# Altium project 探测器.PrjPcb
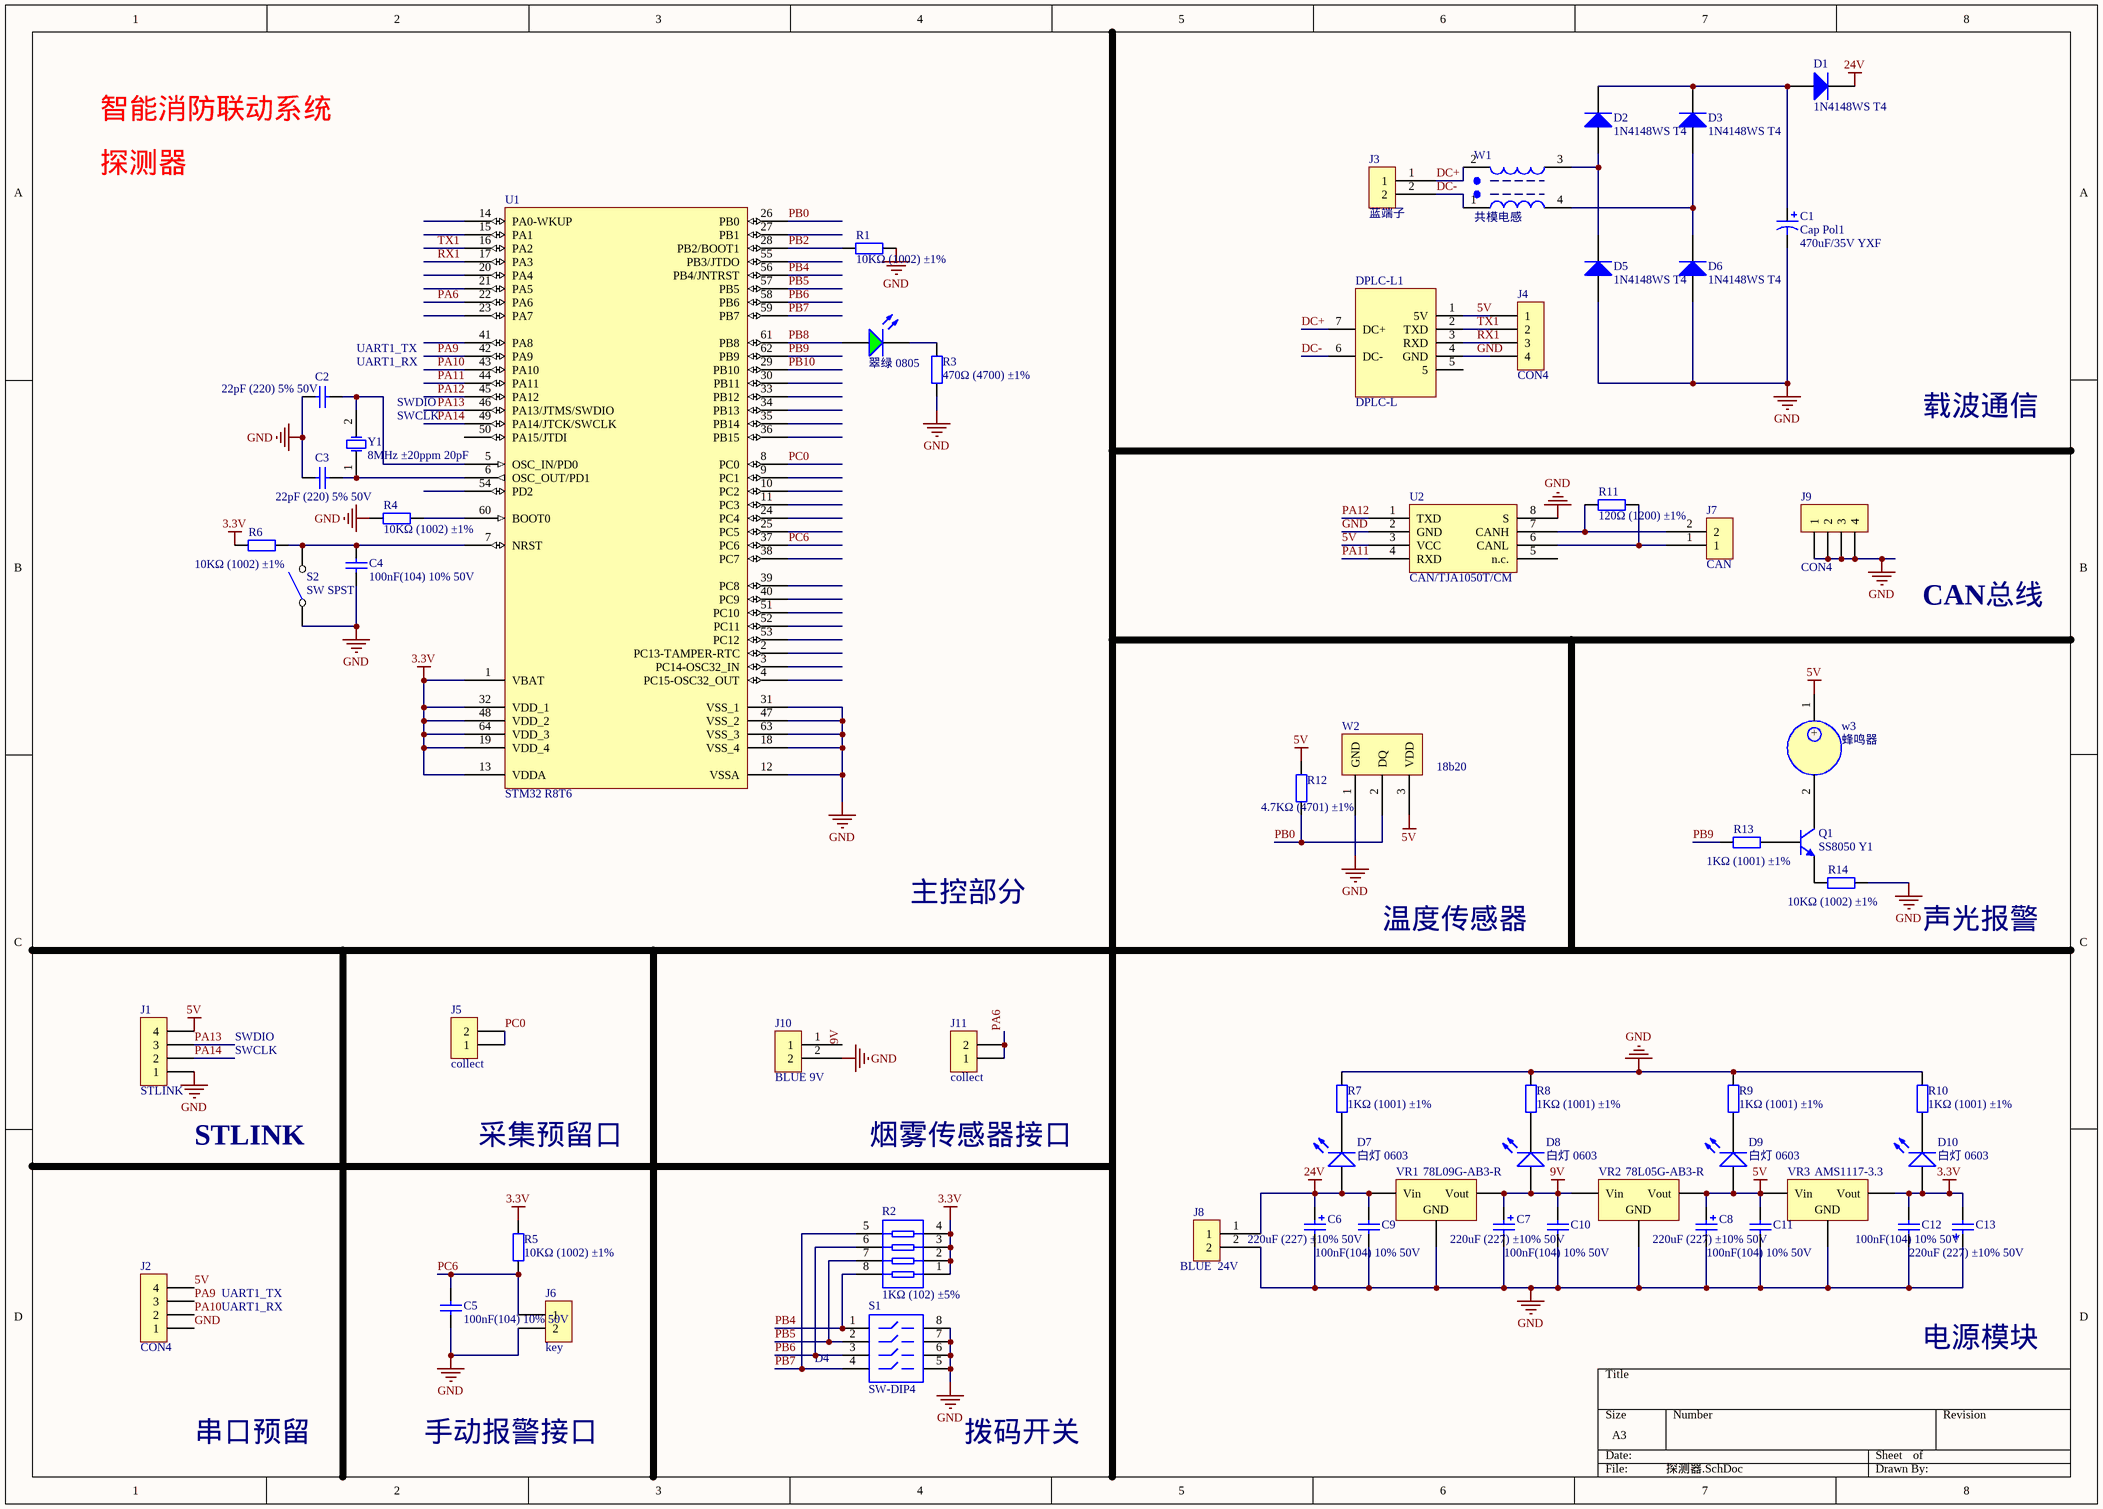
[diagram p0: 探测器.SchDoc]
1 sheet, 61 parts. Net scope: global (net labels, ports and power ports of the same name join across sheets).
Board file: 探测器终.PcbDoc

## Sheet 探测器.SchDoc: 智能消防联动系统
size A3; Time: 2017.05.04; ProjectName: 探测器

### Parts
C1  Cap Pol1  value 470uF/35V YXF  [RB.2/.4]
C2  22pF (220) 5% 50V  [LC-0805_C]
C3  22pF (220) 5% 50V  [LC-0805_C]
C4  100nF(104) 10% 50V  [LC-0805_C]
C5  100nF(104) 10% 50V  [LC-0805_C]
C6  220uF (227) ±10% 50V  [LC-CASE-B_3528]
C7  220uF (227) ±10% 50V  [LC-CASE-B_3528]
C8  220uF (227) ±10% 50V  [LC-CASE-B_3528]
C9  100nF(104) 10% 50V  [LC-0805_C]
C10  100nF(104) 10% 50V  [LC-0805_C]
C11  100nF(104) 10% 50V  [LC-0805_C]
C12  100nF(104) 10% 50V  [LC-0805_C]
C13  220uF (227) ±10% 50V  [LC-CASE-B_3528]
D1  1N4148WS T4  [LC-SOD-323]
D2  1N4148WS T4  [LC-SOD-323]
D3  1N4148WS T4  [LC-SOD-323]
D4  翠绿 0805  [LC-0805_LED_S1]
D5  1N4148WS T4  [LC-SOD-323]
D6  1N4148WS T4  [LC-SOD-323]
D7  白灯 0603  [LC-0603_LED_S1]
D8  白灯 0603  [LC-0603_LED_S1]
D9  白灯 0603  [LC-0603_LED_S1]
D10  白灯 0603  [LC-0603_LED_S1]
DPLC-L1  DPLC-L  [DPLC-L]
J1  STLINK  [SIP4]
J2  CON4  [SIP4]
J3  蓝端子  [蓝端子]
J4  CON4  [SIP4]
J5  collect  [SIP2]
J6  key  [SIP2]
J7  CAN  [蓝端子]
J8  BLUE  24V  [蓝端子]
J9  CON4  [SIP4]
J10  BLUE 9V  [蓝端子]
J11  collect  [SIP2]
Q1  SS8050 Y1  [LC-SOT-23(SOT-23-3)]
R1  10KΩ (1002) ±1%  [LC-0805_R]
R2  1KΩ (102) ±5%  [LC-0603_Rx4]
R3  470Ω (4700) ±1%  [LC-0805_R]
R4  10KΩ (1002) ±1%  [LC-0805_R]
R5  10KΩ (1002) ±1%  [LC-0805_R]
R6  10KΩ (1002) ±1%  [LC-0805_R]
R7  1KΩ (1001) ±1%  [LC-0603_R]
R8  1KΩ (1001) ±1%  [LC-0603_R]
R9  1KΩ (1001) ±1%  [LC-0603_R]
R10  1KΩ (1001) ±1%  [LC-0603_R]
R11  120Ω (1200) ±1%  [LC-0805_R]
R12  4.7KΩ (4701) ±1%  [LC-0805_R]
R13  1KΩ (1001) ±1%  [LC-0805_R]
R14  10KΩ (1002) ±1%  [LC-0805_R]
S1  SW-DIP4  [4位拨码开关]
S2  SW SPST  [单片机小按键]
U1  STM32 R8T6  [LC-LQFP-64_10x10x05P]
U2  CAN/TJA1050T/CM  [LC-SOIC-8_150mil]
VR1  78L09G-AB3-R  [LC-SOT-89(SOT-89-3)]
VR2  78L05G-AB3-R  [LC-SOT-89(SOT-89-3)]
VR3  AMS1117-3.3  [LC-SOT-223]
W1  共模电感  [共模电感]
W2  18b20  [DS18B20]
w3  蜂鸣器  [蜂鸣器]
Y1  8MHz ±20ppm 20pF  [LC-SMD-5032_2P]

### Nets
3.3V: C12.1 C13.2 D10.A R2.1 R2.2 R2.3 R2.4 R5.2 R6.1 U1.1(VBAT) U1.13(VDDA) U1.19(VDD_4) U1.32(VDD_1) U1.48(VDD_2) U1.64(VDD_3) VR3.2(Vout)
5V: C8.1 C11.2 D9.A DPLC-L1.1(5V) J1.4 J2.4 J4.1 R12.2 U2.3(VCC) VR2.3(Vout) VR3.3(Vin) W2.3(VDD) w3.1(+)
9V: C7.1 C10.2 D8.A J10.1 VR1.3(Vout) VR2.1(Vin)
24V: C6.1 C9.2 D1.2(K) D7.A J8.1 VR1.1(Vin)
GND: C1.2 C2.1 C3.1 C4.1 C5.1 C6.2 C7.2 C8.2 C9.1 C10.1 C11.1 C12.2 C13.1 D5.1(A) D6.1(A) DPLC-L1.4(GND) J1.1 J2.1 J4.4 J6.2 J8.2 J9.1 J9.2 J9.3 J9.4 J10.2 R1.1 R3.1 R4.1 R7.1 R8.1 R9.1 R10.1 R14.2 S1.5 S1.6 S1.7 S1.8 S2.1(COMMON) U1.12(VSSA) U1.18(VSS_4) U1.31(VSS_1) U1.47(VSS_2) U1.63(VSS_3) U2.2(GND) U2.8(S) VR1.2(GND) VR2.2(GND) VR3.1(GND) W2.1(GND)
DC+: DPLC-L1.7(DC+) J3.1 W1.2
DC-: DPLC-L1.6(DC-) J3.2 W1.1
PA6: J11.1 J11.2 U1.22(PA6)
PA9: J2.3 U1.42(PA9)
PA10: J2.2 U1.43(PA10)
PA11: U1.44(PA11) U2.4(RXD)
PA12: U1.45(PA12) U2.1(TXD)
PA13: J1.3 U1.46(PA13/JTMS/SWDIO)
PA14: J1.2 U1.49(PA14/JTCK/SWCLK)
PB0: R12.1 U1.26(PB0) W2.2(DQ)
PB2: R1.2 U1.28(PB2/BOOT1)
PB4: R2.8 S1.1 U1.56(PB4/JNTRST)
PB5: R2.7 S1.2 U1.57(PB5)
PB6: R2.6 S1.3 U1.58(PB6)
PB7: R2.5 S1.4 U1.59(PB7)
PB8: D4.A U1.61(PB8)
PB9: R13.1 U1.62(PB9)
PB10: U1.29(PB10)
PC0: J5.1 J5.2 U1.8(PC0)
PC6: C5.2 J6.1 R5.1 U1.37(PC6)
RX1: DPLC-L1.3(RXD) J4.3 U1.17(PA3)
TX1: DPLC-L1.2(TXD) J4.2 U1.16(PA2)
NetC1_1: C1.1 D1.1(A) D2.2(K) D3.2(K)
NetC2_2: C2.2 U1.5(OSC_IN/PD0) Y1.2(OSC2)
NetC3_2: C3.2 U1.6(OSC_OUT/PD1) Y1.1(OSC1)
NetC4_2: C4.2 R6.2 S2.2(NO) U1.7(NRST)
NetD2_1: D2.1(A) D5.2(K) W1.3
NetD3_1: D3.1(A) D6.2(K) W1.4
NetD4_K: D4.K R3.2
NetD7_K: D7.K R7.2
NetD8_K: D8.K R8.2
NetD9_K: D9.K R9.2
NetD10_K: D10.K R10.2
NetJ7_1: J7.1 R11.2 U2.6(CANL)
NetJ7_2: J7.2 R11.1 U2.7(CANH)
NetQ1_1: Q1.1(B) R13.2
NetQ1_2: Q1.2(E) R14.1
NetQ1_3: Q1.3(C) w3.2
NetR4_2: R4.2 U1.60(BOOT0)

Not connected (* = marked no-connect by the designer): DPLC-L1 5; U1 2(PC13-TAMPER-RTC) 3(PC14-OSC32_IN) 4(PC15-OSC32_OUT) 9(PC1) 10(PC2) 11(PC3) 14(PA0-WKUP) 15(PA1) 20(PA4) 21(PA5) 23(PA7) 24(PC4) 25(PC5) 27(PB1) 30(PB11) 33(PB12) 34(PB13) 35(PB14) 36(PB15) 38(PC7) 39(PC8) 40(PC9) 41(PA8) 50(PA15/JTDI) 51(PC10) 52(PC11) 53(PC12) 54(PD2) 55(PB3/JTDO); U2 5(n.c.)

### Notes on the sheet
- 智能消防联动系统
- 探测器
- (near C2) UART1_TX
- (near C2) UART1_RX
- SWDIO
- (near Y1) SWCLK
- 载波通信
- CAN总线
- 主控部分
- 温度传感器
- 声光报警
- SWCLK
- STLINK
- 采集预留口
- 烟雾传感器接口
- UART1_TX
- UART1_RX
- 电源模块
- 串口预留
- 手动报警接口
- 拨码开关

### Library data of the parts
C1 = Cap Pol1: Polarized Capacitor (Radial); Published: 8-Jun-2000; LatestRevisionDate: 17-Jul-2002; LatestRevisionNote: Re-released for DXP Platform.; PackageReference: RB7.6-15; Publisher: Altium Limited; PackageDescription: Polarized Capacitor (Radial); 2 Leads
C2 C3 = 0805 22pF (220) 5% 50V: 贴片电容; ComponentLink1Description: 供应商链接; ComponentLink1URL: http://www.szlcsc.com/product/details_2156.html; Package: 0805; Supplier: LC; SuppliersPartNumber: C1804
C4 C5 C9-C12 = 0805 100nF(104) 10% 50V: 贴片电容; ComponentLink1Description: 供应商链接; ComponentLink1URL: http://www.szlcsc.com/product/details_50686.html; Package: 0805; Supplier: LC; SuppliersPartNumber: C49678
C6-C8 C13 = 3528 100uF (107) 10% 6.3V: 钽电容; ComponentLink1Description: 供应商链接; ComponentLink1URL: http://www.szlcsc.com/product/details_16815.html; Package: 3528; Supplier: LC; SuppliersPartNumber: C16133
D1-D3 D5 D6 = SOD-323 1N4148WS T4: 二极管; ComponentLink1Description: 供应商链接; ComponentLink1URL: http://www.szlcsc.com/product/details_2485.html; Package: SOD-323; Supplier: LC; SuppliersPartNumber: C2128
D4 = 0805 翠绿: 发光二极管; ComponentLink1Description: 供应商链接; ComponentLink1URL: http://www.szlcsc.com/product/details_2670.html; Package: 0805; Supplier: LC; SuppliersPartNumber: C2297
D7-D10 = 0603 白灯: 发光二极管; ComponentLink1Description: 供应商链接; ComponentLink1URL: http://www.szlcsc.com/product/details_2663.html; Package: 0603; Supplier: LC; SuppliersPartNumber: C2290
J1 = CON4
J5 J6 J11 = CON2
J7 J8 J10 = 蓝端子
Q1 = SOT-23 SS8050 Y1: 三极管; ComponentLink1Description: 供应商链接; ComponentLink1URL: http://www.szlcsc.com/product/details_2507.html; Package: SOT-23; Supplier: LC; SuppliersPartNumber: C2150
R1 R4-R6 R14 = 0805 10KΩ (1002) 1%: 贴片电阻; ComponentLink1Description: 供应商链接; ComponentLink1URL: http://www.szlcsc.com/product/details_18102.html; Package: 0805; Supplier: LC; SuppliersPartNumber: C17414
R2 = 0603*4  1KΩ (102) 5%: 贴片排阻; ComponentLink1Description: 供应商链接; ComponentLink1URL: http://www.szlcsc.com/product/details_20907.html; Package: 0603*4; Supplier: LC; SuppliersPartNumber: C20197
R3 = 0805 470Ω (4700) 1%: 贴片电阻; ComponentLink1Description: 供应商链接; ComponentLink1URL: http://www.szlcsc.com/product/details_18398.html; Package: 0805; Supplier: LC; SuppliersPartNumber: C17710
R7-R10 = 0603 1KΩ (1001) 1%: 贴片电阻; ComponentLink1Description: 供应商链接; ComponentLink1URL: http://www.szlcsc.com/product/details_21904.html; Package: 0603; Supplier: LC; SuppliersPartNumber: C21190
R11 = 0805 120Ω (1200) 1%: 贴片电阻; ComponentLink1Description: 供应商链接; ComponentLink1URL: http://www.szlcsc.com/product/details_18125.html; Package: 0805; Supplier: LC; SuppliersPartNumber: C17437
R12 = 0805 4.7KΩ (4701) 1%: 贴片电阻; ComponentLink1Description: 供应商链接; ComponentLink1URL: http://www.szlcsc.com/product/details_18361.html; Package: 0805; Supplier: LC; SuppliersPartNumber: C17673
R13 = 0805 1KΩ (1001) 1%: 贴片电阻; ComponentLink1Description: 供应商链接; ComponentLink1URL: http://www.szlcsc.com/product/details_18201.html; Package: 0805; Supplier: LC; SuppliersPartNumber: C17513
S1 = SW-DIP4: 4位拨码开关
S2 = SW SPST: 单刀单掷开关
U2 = CAN/TJA1050T/CM: CAN; ComponentLink1Description: 供应商链接; ComponentLink1URL: http://www.szlcsc.com/product/details_7424.html; Package: SOIC-8_150mil; Supplier: LC; SuppliersPartNumber: C6952
VR1 = SOT-89 78L12G-AB3-R: 低压差线性稳压(LDO); ComponentLink1Description: 供应商链接; ComponentLink1URL: http://www.szlcsc.com/product/details_76626.html; Package: SOT-89; Supplier: LC; SuppliersPartNumber: C75501
VR2 = SOT-89 78L05G-AB3-R: 低压差线性稳压(LDO); ComponentLink1Description: 供应商链接; ComponentLink1URL: http://www.szlcsc.com/product/details_72235.html; Package: SOT-89; Supplier: LC; SuppliersPartNumber: C71136
VR3 = SOT-223 AMS1117-3.3: 低压差线性稳压(LDO); ComponentLink1Description: 供应商链接; ComponentLink1URL: http://www.szlcsc.com/product/details_6652.html; Package: SOT-223; Supplier: LC; SuppliersPartNumber: C6186
Y1 = SMD-5032_2P 8MHz 20ppm 20pF: 贴片晶振; ComponentLink1Description: 供应商链接; ComponentLink1URL: http://www.szlcsc.com/product/details_19261.html; Package: SMD-5032_2P; Supplier: LC; SuppliersPartNumber: C18560